# Altium project GSMModule.PrjPCB
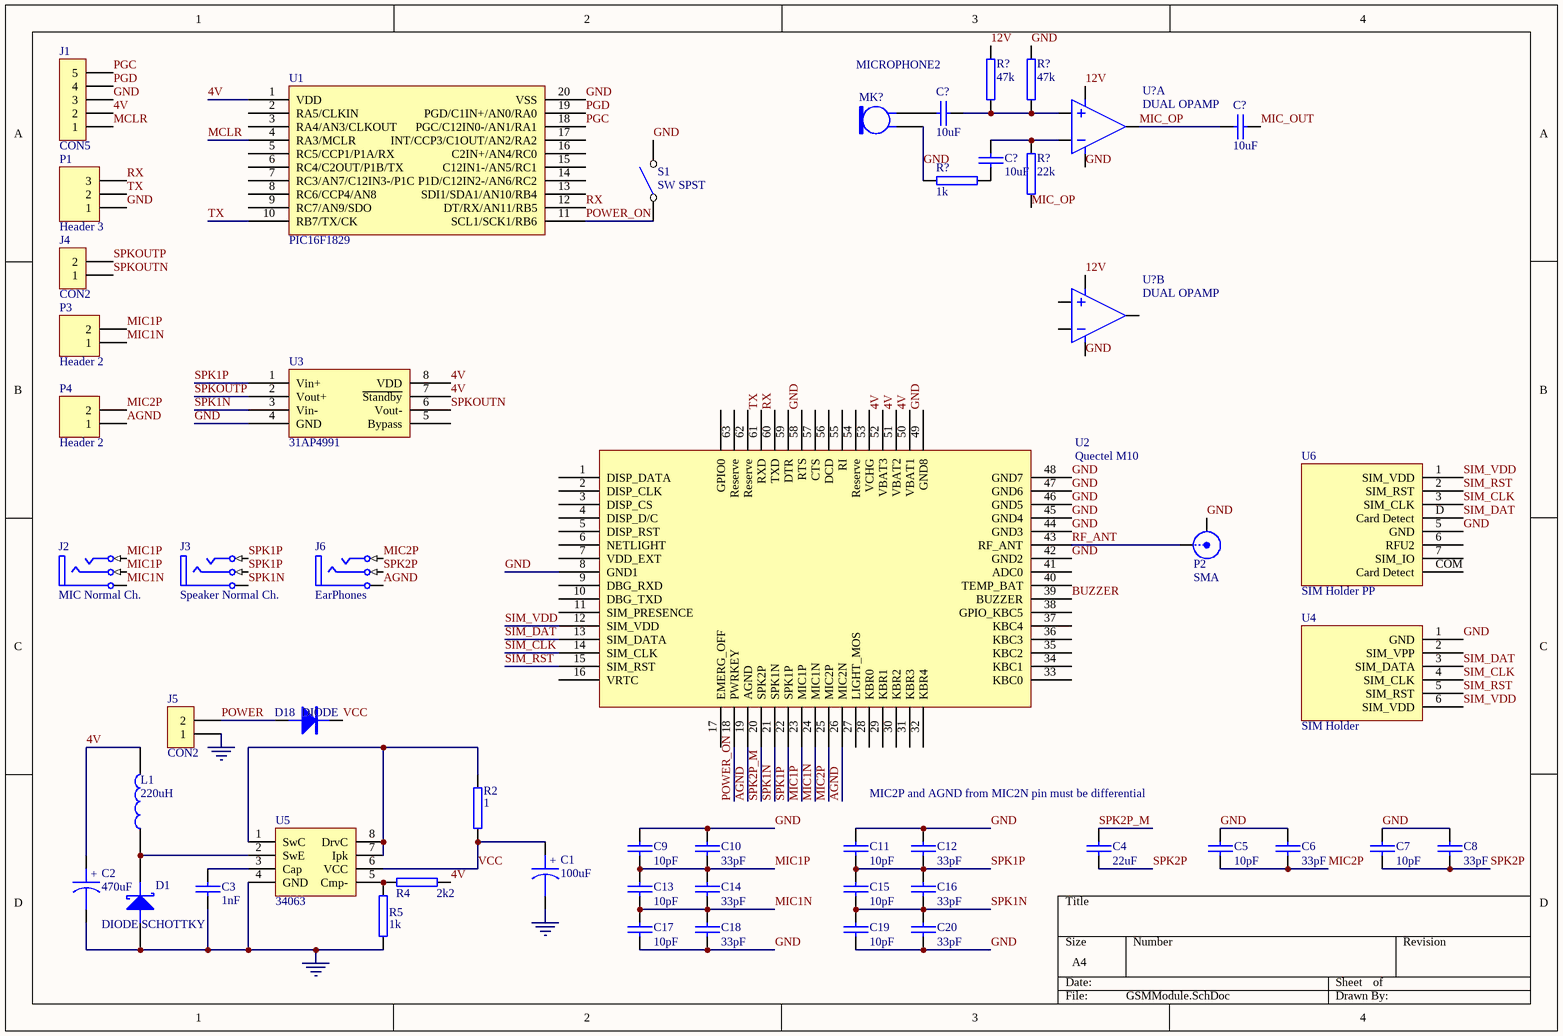
[diagram p0: GSMModule.SchDoc]
1 sheet, 53 parts. Net scope: global (net labels, ports and power ports of the same name join across sheets).
Board file: GSMModule.PcbDoc

## Sheet GSMModule.SchDoc
size A4

### Parts
(Parts that share a designator on the sheet are numbered #1, #2 ... from top to bottom, then left to right.)
C1  100uF  [RA 6.3MM]
C2  470uF  [RA 6.3MM]
C3  1nF  [0603]
C4  22uF  [0603]
C5  10pF  [0603]
C6  33pF  [0603]
C7  10pF  [0603]
C8  33pF  [0603]
C9  10pF  [0603]
C10  33pF  [0603]
C11  10pF  [0603]
C12  33pF  [0603]
C13  10pF  [0603]
C14  33pF  [0603]
C15  10pF  [0603]
C16  33pF  [0603]
C17  10pF  [0603]
C18  33pF  [0603]
C19  10pF  [0603]
C20  33pF  [0603]
C?#1  10uF  [0805]
C?#2  10uF  [0805]
C?#3  10uF  [0805]
D1  DIODE SCHOTTKY  [DIODE0.4 + SMA]
D18  DIODE  [DIODE0.4 + SMA]
J1  CON5  [SIP5 - PGM]
J2  MIC Normal Ch.  [Stereo Jack F]
J3  Speaker Normal Ch.  [Stereo Jack F]
J4  CON2  [HD-515V 2P]
J5  CON2  [HD-515V 2P]
J6  EarPhones  [Stereo Jack F]
L1  220uH  [RA 6.3MM]
MK?  MICROPHONE2
P1  Header 3  [HDR1X3]
P2  SMA  [SMB_V-RJ45]
P3  Header 2  [HDR1X2]
P4  Header 2  [HDR1X2]
R2  1  [0805]
R4  2k2  [0603]
R5  1k  [0603]
R?#1  47k  [0603]
R?#2  47k  [0603]
R?#3  1k  [0603]
R?#4  22k  [0603]
S1  SW SPST  [TactBut]
U1  PIC16F1829  [SOIC20WIDE]
U2  Quectel M10  [QUECTEL_M10]
U3  31AP4991  [SO-8]
U4  SIM Holder  [SIM Holder]
U5  34063  [SO-8]
U6  SIM Holder PP  [SIM HOLDER PUSH]
U?#1  DUAL OPAMP  [SO-8]  (part A of 2)
U?#2  DUAL OPAMP  [SO-8]  (part B of 2)

### Nets
GND: C1.2 C2.2 C3.2 C5.1 C6.1 C7.1 C8.1 C9.1 C10.1 C11.1 C12.1 C17.2 C18.2 C19.2 C20.2 D1.A J1.3 J5.1 MK?.1 P1.1 P2.2(Y) R5.2 R?#2.1 R?#3.2 S1.2(NO) U1.20(VSS) U2.8(GND1) U2.42(GND2) U2.44(GND3) U2.45(GND4) U2.46(GND5) U2.47(GND6) U2.48(GND7) U2.49(GND8) U2.58(RTS) U3.4(GND) U4.1(GND) U5.4(GND) U6.5(GND) U?#1.4(V-) U?#2.4(V-)
4V: C2.1 J1.2 L1.2 R4.1 U1.1(VDD) U2.50(VBAT1) U2.51(VBAT2) U2.52(VBAT3) U3.7(~{Standby}) U3.8(VDD)
12V: R?#1.1 U?#1.8(V+) U?#2.8(V+)
AGND: J6.1(S) P4.1 U2.19(AGND) U2.26(MIC2N)
BUZZER: U2.39(BUZZER)
MCLR: J1.1 U1.4(RA3/MCLR)
MIC1N: C13.2 C14.2 C17.1 C18.1 J2.1(S) P3.1 U2.24(MIC1N)
MIC1P: C9.2 C10.2 C13.1 C14.1 J2.2(T) J2.5(R) P3.2 U2.23(MIC1P)
MIC2P: C5.2 C6.2 J6.2(T) P4.2 U2.25(MIC2P)
MIC_OP: C?#2.1 R?#4.1 U?#1.1(OUT)
MIC_OUT: C?#2.2
PGC: J1.5 U1.18(PGC/C12IN0-/AN1/RA1)
PGD: J1.4 U1.19(PGD/C1IN+/AN0/RA0)
POWER: D18.A J5.2
POWER_ON: S1.1(COMMON) U1.11(SCL1/SCK1/RB6) U2.18(PWRKEY)
RF_ANT: P2.1(X) U2.43(RF_ANT)
RX: P1.3 U1.12(DT/RX/AN11/RB5) U2.60(TXD)
SIM_CLK: U2.14(SIM_CLK) U4.4(SIM_CLK) U6.3(SIM_CLK)
SIM_DAT: U2.13(SIM_DATA) U4.3(SIM_DATA) U6.D(Card_Detect)
SIM_RST: U2.15(SIM_RST) U4.5(SIM_RST) U6.2(SIM_RST)
SIM_VDD: U2.12(SIM_VDD) U4.6(SIM_VDD) U6.1(SIM_VDD)
SPK1N: C15.2 C16.2 C19.1 C20.1 J3.1(S) U2.21(SPK1N) U3.3(Vin-)
SPK1P: C11.2 C12.2 C15.1 C16.1 J3.2(T) J3.5(R) U2.22(SPK1P) U3.1(Vin+)
SPK2P: C4.2 C7.2 C8.2 J6.5(R)
SPK2P_M: C4.1 U2.20(SPK2P)
SPKOUTN: J4.1 U3.6(Vout-)
SPKOUTP: J4.2 U3.2(Vout+)
TX: P1.2 U1.10(RB7/TX/CK) U2.61(RXD)
VCC: C1.1 D18.K R2.2 U5.6(VCC)
NetC3_1: C3.1 U5.3(Cap)
NetC?#1_1: C?#1.1 MK?.2
NetC?#1_2: C?#1.2 R?#1.2 R?#2.2 U?#1.3(IN+)
NetC?#3_1: C?#3.1 R?#4.2 U?#1.2(IN-)
NetC?#3_2: C?#3.2 R?#3.1
NetD1_K: D1.K L1.1 U5.2(SwE)
NetR2_1: R2.1 U5.1(SwC) U5.7(Ipk) U5.8(DrvC)
NetR4_2: R4.2 R5.1 U5.5(Cmp-)

Not connected (* = marked no-connect by the designer): U1 2(RA5/CLKIN) 3(RA4/AN3/CLKOUT) 5(RC5/CCP1/P1A/RX) 6(RC4/C2OUT/P1B/TX) 7(RC3/AN7/C12IN3-/P1C) 8(RC6/CCP4/AN8) 9(RC7/AN9/SDO) 13(SDI1/SDA1/AN10/RB4) 14(P1D/C12IN2-/AN6/RC2) 15(C12IN1-/AN5/RC1) 16(C2IN+/AN4/RC0) 17(INT/CCP3/C1OUT/AN2/RA2); U2 1(DISP_DATA) 2(DISP_CLK) 3(DISP_CS) 4(DISP_D/C) 5(DISP_RST) 6(NETLIGHT) 7(VDD_EXT) 9(DBG_RXD) 10(DBG_TXD) 11(SIM_PRESENCE) 16(VRTC) 17(EMERG_OFF) 27(LIGHT_MOS) 28(KBR0) 29(KBR1) 30(KBR2) 31(KBR3) 32(KBR4) 33(KBC0) 34(KBC1) 35(KBC2) 36(KBC3) 37(KBC4) 38(GPIO_KBC5) 40(TEMP_BAT) 41(ADC0) 53(VCHG) 54(Reserve) 55(RI) 56(DCD) 57(CTS) 59(DTR) 62(Reserve) 63(Reserve) 64(GPIO0); U3 5(Bypass); U4 2(SIM_VPP); U6 6(RFU2) 7(SIM_IO) COM(Card_Detect); U?#2 5(IN+) 6(IN-) 7(OUT)

### Notes on the sheet
- MIC2P and AGND from MIC2N pin must be differential
- (in symbol CAPACITOR POL) +

### Library data of the parts
C1 C2 = CAPACITOR POL: Capacitor
C3-C20 C?#1-C?#3 = CAP: Capacitor
D1 = DIODE SCHOTTKY: Schottky Diode
J1 = CON5: Connector
J2 J3 J6 = Phonejack3: Jack Socket, 1/4" [6.5mm], Thru-Hole, Vertical, 3-Conductor Open Circuit (Non-Normalling); PackageDocument: 2003; PCB_Layout: Complies with manufacturer's recommendation.; DrillAndSlotSize: Corresponds to nominal value.; Published: 15-Jul-2004; LatestRevisionDate: 15-Jul-2004; LatestRevisionNote: Component Replaced.; DatasheetDocument: 2003; PackageReference: S1VS_SSS; Publisher: Altium Limited; ComponentLink1Description: Manufacturer Link; ComponentLink1URL: http://www.cliffuk.co.uk/
J4 J5 = CON2: Connector
L1 = INDUCTOR1
MK? = MICROPHONE2: Microphone
P1 = Header 3: Header, 3-Pin; LatestRevisionDate: 17-Jul-2002; LatestRevisionNote: Re-released for DXP Platform.; Publisher: Altium Limited
P2 = SMB: SMB Straight Connector; LatestRevisionDate: 17-Jul-2002; LatestRevisionNote: Re-released for DXP Platform.; Publisher: Altium Limited
P3 P4 = Header 2: Header, 2-Pin; LatestRevisionDate: 17-Jul-2002; LatestRevisionNote: Re-released for DXP Platform.; Publisher: Altium Limited
R2 R4 R5 R?#1-R?#4 = RES2
U1 = PIC16F1829: Microchip Microcontroller
U2 = Quectel M10: GSM Module Quectel M10
U3 = Differential Amplifier: Op-amp with differential inputs
U4 = SIM Holder: 6-Pin SIM Holder
U5 = 34063: DC/DC converter
U6 = SIM Holder PP: 8-Pin SIM Holder Push-Push